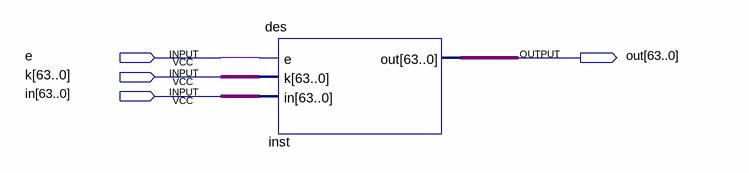
[diagram p0: schematic sheet]
// Quartus schematic des_top.bdf as structural Verilog: 1 symbols, 4 pins
module des_top (
  input  e,
  input  [63:0] k,
  input  [63:0] in,
  output [63:0] out
);

  des inst (.e(e), .k(k), .in(in), .out(out));
endmodule
